# EAGLE design TSOC_GROVEY_ADC (EAGLE 6.6.0)
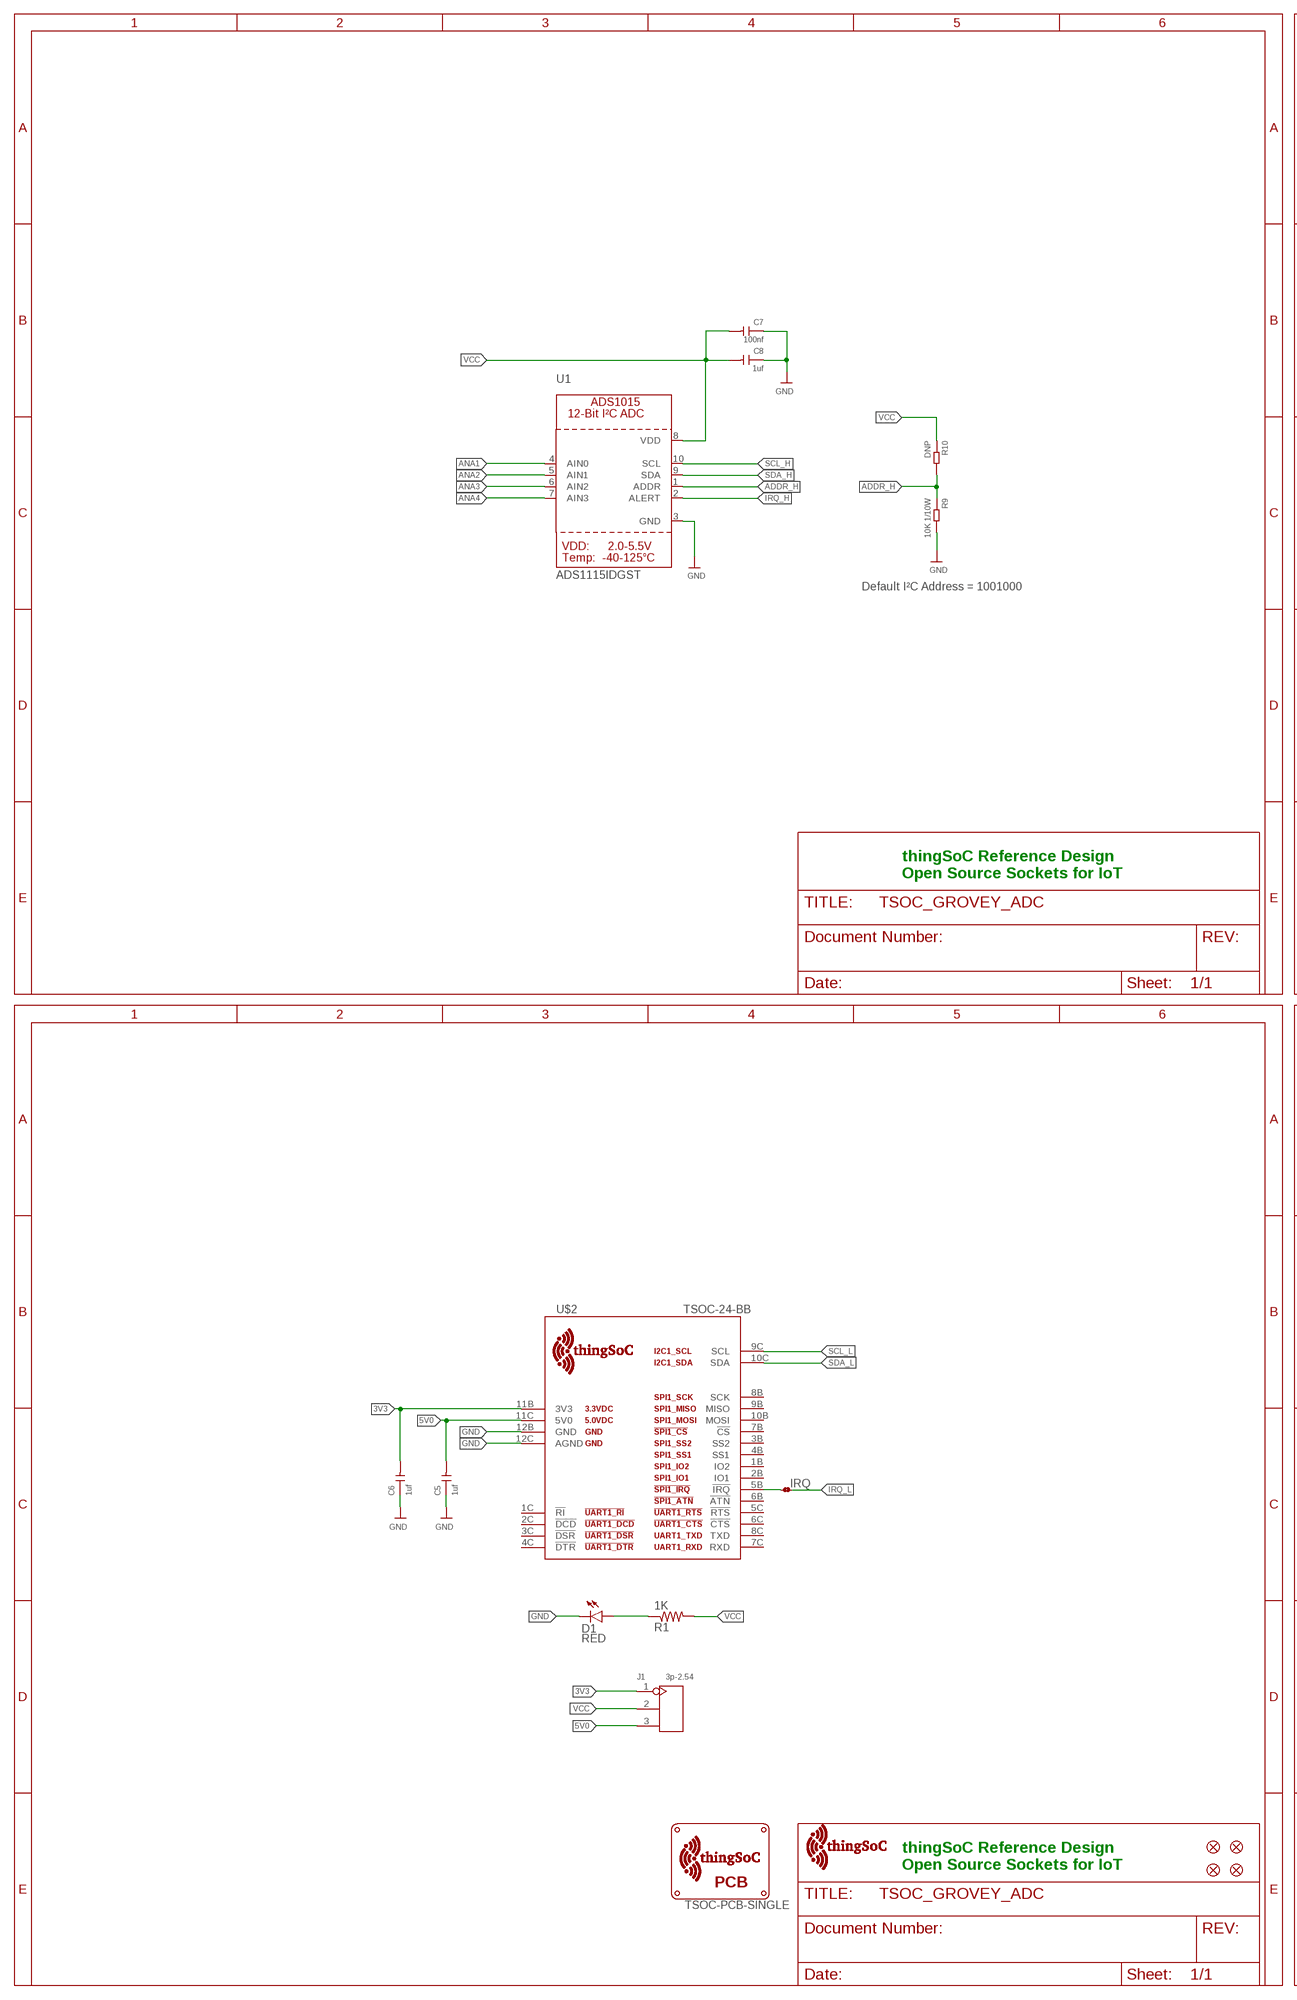
[diagram p0: schematic, sheet 1, part 1 of 2]
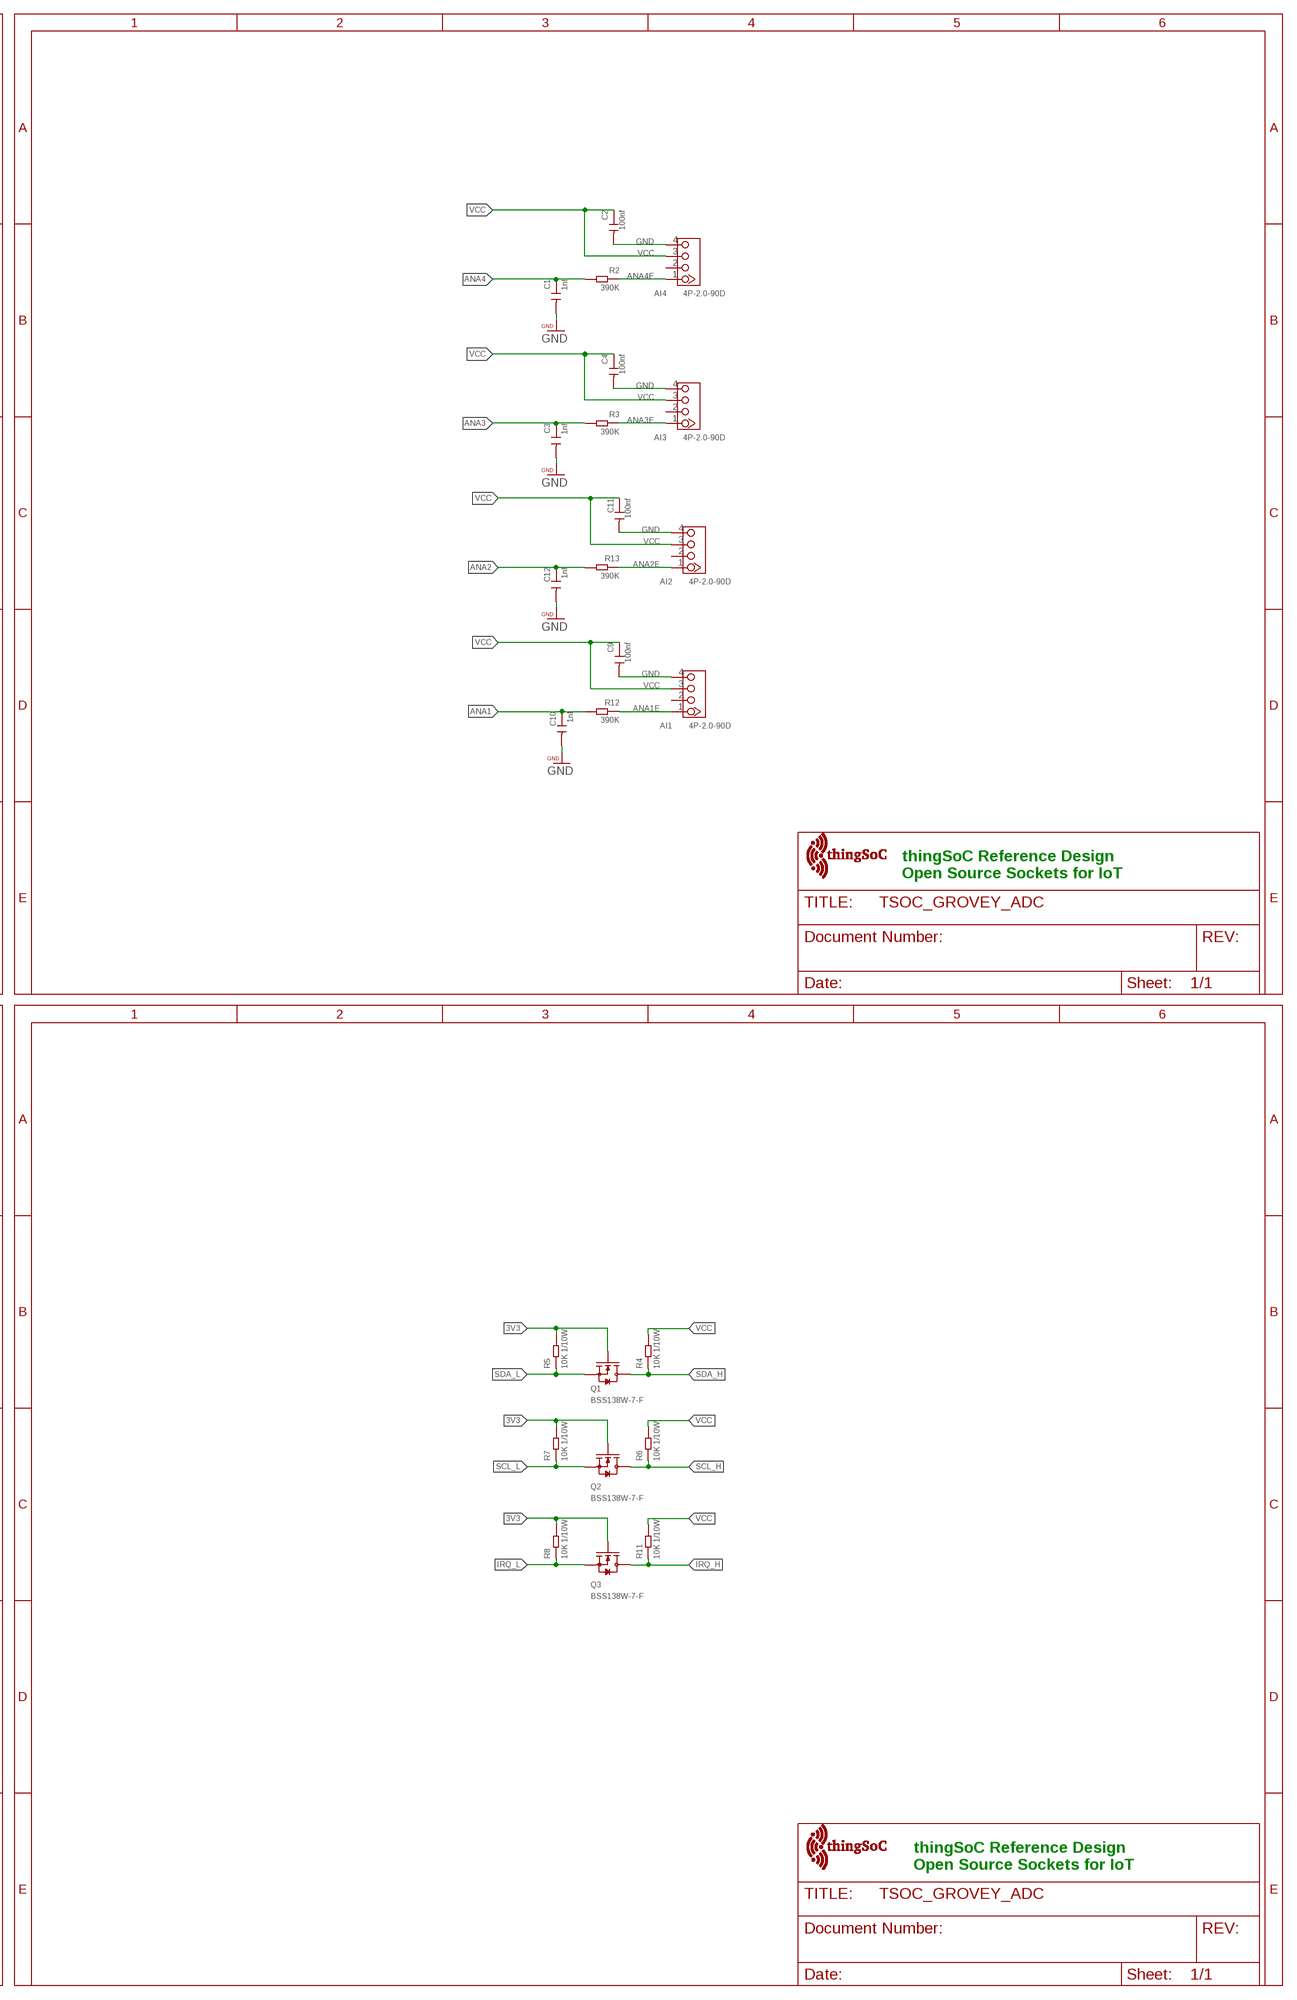
[diagram p1: schematic, sheet 1, part 2 of 2]

## Parts
AI1  4P-2.0-90D  GROVE-CONNECTOR-DIP-90D(4P-2.0)  [HW4-2.0-90D]
AI2  4P-2.0-90D  GROVE-CONNECTOR-DIP-90D(4P-2.0)  [HW4-2.0-90D]
AI3  4P-2.0-90D  GROVE-CONNECTOR-DIP-90D(4P-2.0)  [HW4-2.0-90D]
AI4  4P-2.0-90D  GROVE-CONNECTOR-DIP-90D(4P-2.0)  [HW4-2.0-90D]
C1  1nf  CERAMIC-1NF-50V-5%-C0G(0603)  [C0603]
C2  100nf  CERAMIC-100NF-50V-10%-X7R(0603)  [C0603]
C3  1nf  CERAMIC-1NF-50V-5%-C0G(0603)  [C0603]
C4  100nf  CERAMIC-100NF-50V-10%-X7R(0603)  [C0603]
C5  1uf  CERAMIC-1UF-25V-10%-X7R(0603)  [C0603]
C6  1uf  CERAMIC-1UF-25V-10%-X7R(0603)  [C0603]
C7  100nf  CERAMIC-100NF-50V-10%-X7R(0603)  [C0603]
C8  1uf  CERAMIC-1UF-25V-10%-X7R(0603)  [C0603]
C9  100nf  CERAMIC-100NF-50V-10%-X7R(0603)  [C0603]
C10  1nf  CERAMIC-1NF-50V-5%-C0G(0603)  [C0603]
C11  100nf  CERAMIC-100NF-50V-10%-X7R(0603)  [C0603]
C12  1nf  CERAMIC-1NF-50V-5%-C0G(0603)  [C0603]
D1  RED  LED0603  [LED-0603]
FID1  FIDUCIALUFIDUCIAL  [MICRO-FIDUCIAL]
FID2  FIDUCIALUFIDUCIAL  [MICRO-FIDUCIAL]
FID3  FIDUCIALUFIDUCIAL  [MICRO-FIDUCIAL]
FID4  FIDUCIALUFIDUCIAL  [MICRO-FIDUCIAL]
IRQ  JMP-2-NO  [JMP-2-NO]
J1  3p-2.54  DIP-BLACK-MALE-HEADER-VERT(3P-2.54)  [H3-2.54]
Q1  BSS138W-7-F  SMD-MOSFET-N-CH-50V-200MA-BSS138W-7-F(SOT-23)  [SOT-23]
Q2  BSS138W-7-F  SMD-MOSFET-N-CH-50V-200MA-BSS138W-7-F(SOT-23)  [SOT-23]
Q3  BSS138W-7-F  SMD-MOSFET-N-CH-50V-200MA-BSS138W-7-F(SOT-23)  [SOT-23]
R1  1K  RESISTOR_SFE0603-RES  [0603-RES]
R2  390K  SMD-RES-150K-1%-1/10W(0603)  [R0603]
R3  390K  SMD-RES-150K-1%-1/10W(0603)  [R0603]
R4  10K 1/10W  SMD-RES-10K-5%-1/10W(0603)  [R0603]
R5  10K 1/10W  SMD-RES-10K-5%-1/10W(0603)  [R0603]
R6  10K 1/10W  SMD-RES-10K-5%-1/10W(0603)  [R0603]
R7  10K 1/10W  SMD-RES-10K-5%-1/10W(0603)  [R0603]
R8  10K 1/10W  SMD-RES-10K-5%-1/10W(0603)  [R0603]
R9  10K 1/10W  SMD-RES-10K-5%-1/10W(0603)  [R0603]
R10  DNP  SMD-RES-10K-5%-1/10W(0603)  [R0603]
R11  10K 1/10W  SMD-RES-10K-5%-1/10W(0603)  [R0603]
R12  390K  SMD-RES-150K-1%-1/10W(0603)  [R0603]
R13  390K  SMD-RES-150K-1%-1/10W(0603)  [R0603]
U1  ADS1115IDGST  ADC_ADS1015  [MSOP10]
U$1  TSOC-PCB-SINGLE  [TSOC-BB-BRD-DIM]
U$2  TSOC-24-BB  [TSOC-BB-S24]
U$100  TSOC-LOGO-SMALL  [TSOC-LOGO-SML]
U$102  TSOC-LOGO-LRG  [TSOC-LOGO-LRG]
U$103  TSOC-LOGO-SMALL  [TSOC-LOGO-SML]

## Nets
3V3: C6.2 J1.1 Q1.1(G) Q2.1(G) Q3.1(G) R5.2 R7.2 R8.2 U$2.11B(3V3)
5V0: C5.2 J1.3 U$2.11C(5V0)
ADDR_H: R9.1 R10.2 U1.1(ADDR)
ANA1: C10.1 R12.2 U1.4(AIN0)
ANA1E: AI1.1 R12.1
ANA2: C12.1 R13.2 U1.5(AIN1)
ANA2E: AI2.1 R13.1
ANA3: C3.1 R3.2 U1.6(AIN2)
ANA3E: AI3.1 R3.1
ANA4: C1.1 R2.2 U1.7(AIN3)
ANA4E: AI4.1 R2.1
GND: AI1.4 AI2.4 AI3.4 AI4.4 C1.2 C2.2 C3.2 C4.2 C5.1 C6.1 C7.1 C8.1 C9.2 C10.2 C11.2 C12.2 D1.C R9.2 U1.3(GND) U$2.12B(GND) U$2.12C(AGND)
IRQ_H: Q3.3(D) R11.1 U1.2(ALERT)
IRQ_L: IRQ.2 Q3.2(S) R8.1
IRQE: IRQ.1 U$2.5B(!IRQ)
N$17: D1.A R1.1
SCL_H: Q2.3(D) R6.1 U1.10(SCL)
SCL_L: Q2.2(S) R7.1 U$2.9C(SCL)
SDA_H: Q1.3(D) R4.1 U1.9(SDA)
SDA_L: Q1.2(S) R5.1 U$2.10C(SDA)
VCC: AI1.3 AI2.3 AI3.3 AI4.3 C2.1 C4.1 C7.2 C8.2 C9.1 C11.1 J1.2 R1.2 R4.2 R6.2 R10.1 R11.2 U1.8(VDD)
Unconnected: AI1.2 AI2.2 AI3.2 AI4.2 U$2.1B(IO2) U$2.1C(!RI) U$2.2B(IO1) U$2.2C(!DCD) U$2.3B(SS2) U$2.3C(!DSR) U$2.4B(SS1) U$2.4C(!DTR) U$2.5C(!RTS) U$2.6B(!ATN) U$2.6C(!CTS) U$2.7B(!CS) U$2.7C(RXD) U$2.8B(SCK) U$2.8C(TXD) U$2.9B(MISO) U$2.10B(MOSI)

## Notes on the sheet
- Default I²C Address = 1001000
- thingSoC Reference Design
  Open Source Sockets for IoT
- thingSoC Reference Design
  Open Source Sockets for IoT
- thingSoC Reference Design
  Open Source Sockets for IoT
- thingSoC Reference Design
  Open Source Sockets for IoT

## Library data of the parts
AI1-AI4 = Seeed-Connector -2016:GROVE-CONNECTOR-DIP-90D(4P-2.0): 320110034
C1 C3 C10 C12 = Seeed-Capacitor-2016:CERAMIC-1NF-50V-5%-C0G(0603): 302010341; MPN: GRM1885C1H102JA01D
C2 C4 C7 C9 C11 = Seeed-Capacitor-2016:CERAMIC-100NF-50V-10%-X7R(0603): 302010138; MPN: CC0603KRX7R9BB104
C5 C6 C8 = Seeed-Capacitor-2016:CERAMIC-1UF-25V-10%-X7R(0603): 302010139; MPN: CC0603KRX7R8BB105
D1 = TSOC-ESP8266-BASE:LED: LEDs Standard schematic elements and footprints for 5mm, 3mm, 1206, and 0603 sized LEDs. 5mm - Spark Fun Electronics SKU : COM-00529 (and others)
FID1-FID4 = TSOC-ESP8266-BASE:FIDUCIAL: Fiducial Alignment Points Various fiducial points for machine vision alignment.
IRQ = PatternAgents-ProtoPads:JMP-2-NO: Two Terminal Jumper - Normally Open Positions 1 and 2 are normally NOT connected. PatternAgents ProtoPads Library Schematic and PCB layout libraries for design patterns by PatternAgents. For the CADSoft Eagle CAD program : http://www.cadsoftusa.com/download-eagle/ Source LBR : http://www.patternagents.com Github : https://github.com/PatternAgents License : http://creativecommons.org/licenses/by-sa/4.0/ (Creative Commons 4.0) THIS SOFTWARE IS PROVIDED BY THE CONTRIBUTORS "AS IS" AND WITHOUT ANY EXPRESS OR IMPLIED WARRANTIES, INCLUDING, BUT NOT LIMITED TO, THE IMPLIED WARRANTIES OF MERCHANTABILITY AND FITNESS FOR A PARTICULAR PURPOSE ARE DISCLAIMED. IN NO EVENT SHALL THE COPYRIGHT OWNER OR CONTRIBUTORS BE LIABLE FOR ANY DIRECT, INDIRECT, INCIDENTAL, SPECIAL, EXEMPLARY, OR CONSEQUENTIAL DAMAGES (INCLUDING, BUT NOT LIMITED TO, PROCUREMENT OF SUBSTITUTE GOODS OR SERVICES; LOSS OF USE, DATA, OR PROFITS; OR BUSINESS INTERRUPTION) HOWEVER CAUSED AND ON ANY THEORY OF LIABILITY, WHETHER IN CONTRACT, STRICT LIABILITY, OR TORT (INCLUDING NEGLIGENCE OR OTHERWISE) ARISING IN ANY WAY OUT OF THE USE OF THIS SOFTWARE, EVEN IF ADVISED OF THE POSSIBILITY OF SUCH DAMAGE.; BOM: EXCLUDE
J1 = Seeed-Connector -2016:DIP-BLACK-MALE-HEADER-VERT(3P-2.54): 320020079
Q1-Q3 = Seeed-Transistor-2016:SMD-MOSFET-N-CH-50V-200MA-BSS138W-7-F(SOT-23): 305030000; MPN: BSS138W-7-F
R1 = PatternAgents-Misc:RESISTOR_SFE: Resistor Basic schematic elements and footprints for 0603, 1206, and PTH resistors.
R2 R3 R12 R13 = Seeed-Resistor-2016:SMD-RES-150K-1%-1/10W(0603): 301010205; MPN: RC0603FR-07150KL; VALUE: 150K
R4-R9 R11 = Seeed-Resistor-2016:SMD-RES-10K-5%-1/10W(0603): 301010293; MPN: RC0603JR-0710KL
R10 = Seeed-Resistor-2016:SMD-RES-10K-5%-1/10W(0603): 301010293; MPN: RC0603JR-0710KL; VALUE: 10K 1/10W
U1 = microbuilder:ADC_ADS1015: ADS1015 - 12-bit 4-Channel I2C ADC with Internal PGA VDD: 2.0-5.5V Sampling Rate: 3.3ksps Gain Settings: 2/3, 1, 2, 4, 8, 16 I2C Address: ADDR low = 1001000x, ADDR high = 1001001x Internal Comparator The ADS1015 includes an internal comparator that can be set to output a high-level on ALERT when the conversion results exceeeds a pre-defined upper level, and will deassert itself when the level falls below a pre-defined lower threshold level. It can also be set to windowed mode where the ALERT pin will be asserted if the data exceeds the upper threshold or falls below the lower threshold.
U$1 = thingSoC:TSOC-PCB: thingSoC PCB Outlines Boards Outlines for Standard Sizes (in the DImension Layer) (Registration marks in the tDocu layer - make sure to turn on tDocu/bDocu) Source LBR : http://www.thingsoc.com Github : https://github.com/thingsoc License : http://creativecommons.org/licenses/by-sa/4.0/ (Creative Commons 4.0) THIS SOFTWARE IS PROVIDED BY THE CONTRIBUTORS "AS IS" AND WITHOUT ANY EXPRESS OR IMPLIED WARRANTIES, INCLUDING, BUT NOT LIMITED TO, THE IMPLIED WARRANTIES OF MERCHANTABILITY AND FITNESS FOR A PARTICULAR PURPOSE ARE DISCLAIMED. IN NO EVENT SHALL THE COPYRIGHT OWNER OR CONTRIBUTORS BE LIABLE FOR ANY DIRECT, INDIRECT, INCIDENTAL, SPECIAL, EXEMPLARY, OR CONSEQUENTIAL DAMAGES (INCLUDING, BUT NOT LIMITED TO, PROCUREMENT OF SUBSTITUTE GOODS OR SERVICES; LOSS OF USE, DATA, OR PROFITS; OR BUSINESS INTERRUPTION) HOWEVER CAUSED AND ON ANY THEORY OF LIABILITY, WHETHER IN CONTRACT, STRICT LIABILITY, OR TORT (INCLUDING NEGLIGENCE OR OTHERWISE) ARISING IN ANY WAY OUT OF THE USE OF THIS SOFTWARE, EVEN IF ADVISED OF THE POSSIBILITY OF SUCH DAMAGE.
U$2 = thingSoC:TSOC-24: thingSoC Twenty-Four(24) Pin Socket Source LBR : http://www.thingsoc.com Github : https://github.com/thingsoc License : http://creativecommons.org/licenses/by-sa/4.0/ (Creative Commons 4.0) THIS SOFTWARE IS PROVIDED BY THE CONTRIBUTORS "AS IS" AND WITHOUT ANY EXPRESS OR IMPLIED WARRANTIES, INCLUDING, BUT NOT LIMITED TO, THE IMPLIED WARRANTIES OF MERCHANTABILITY AND FITNESS FOR A PARTICULAR PURPOSE ARE DISCLAIMED. IN NO EVENT SHALL THE COPYRIGHT OWNER OR CONTRIBUTORS BE LIABLE FOR ANY DIRECT, INDIRECT, INCIDENTAL, SPECIAL, EXEMPLARY, OR CONSEQUENTIAL DAMAGES (INCLUDING, BUT NOT LIMITED TO, PROCUREMENT OF SUBSTITUTE GOODS OR SERVICES; LOSS OF USE, DATA, OR PROFITS; OR BUSINESS INTERRUPTION) HOWEVER CAUSED AND ON ANY THEORY OF LIABILITY, WHETHER IN CONTRACT, STRICT LIABILITY, OR TORT (INCLUDING NEGLIGENCE OR OTHERWISE) ARISING IN ANY WAY OUT OF THE USE OF THIS SOFTWARE, EVEN IF ADVISED OF THE POSSIBILITY OF SUCH DAMAGE.
U$100 U$102 U$103 = thingSoC:TSOC-LOGO: thingSoC Logo Source LBR : http://www.thingsoc.com Github : https://github.com/thingsoc License : http://creativecommons.org/licenses/by-sa/4.0/ (Creative Commons 4.0) THIS SOFTWARE IS PROVIDED BY THE CONTRIBUTORS "AS IS" AND WITHOUT ANY EXPRESS OR IMPLIED WARRANTIES, INCLUDING, BUT NOT LIMITED TO, THE IMPLIED WARRANTIES OF MERCHANTABILITY AND FITNESS FOR A PARTICULAR PURPOSE ARE DISCLAIMED. IN NO EVENT SHALL THE COPYRIGHT OWNER OR CONTRIBUTORS BE LIABLE FOR ANY DIRECT, INDIRECT, INCIDENTAL, SPECIAL, EXEMPLARY, OR CONSEQUENTIAL DAMAGES (INCLUDING, BUT NOT LIMITED TO, PROCUREMENT OF SUBSTITUTE GOODS OR SERVICES; LOSS OF USE, DATA, OR PROFITS; OR BUSINESS INTERRUPTION) HOWEVER CAUSED AND ON ANY THEORY OF LIABILITY, WHETHER IN CONTRACT, STRICT LIABILITY, OR TORT (INCLUDING NEGLIGENCE OR OTHERWISE) ARISING IN ANY WAY OUT OF THE USE OF THIS SOFTWARE, EVEN IF ADVISED OF THE POSSIBILITY OF SUCH DAMAGE.

## Board
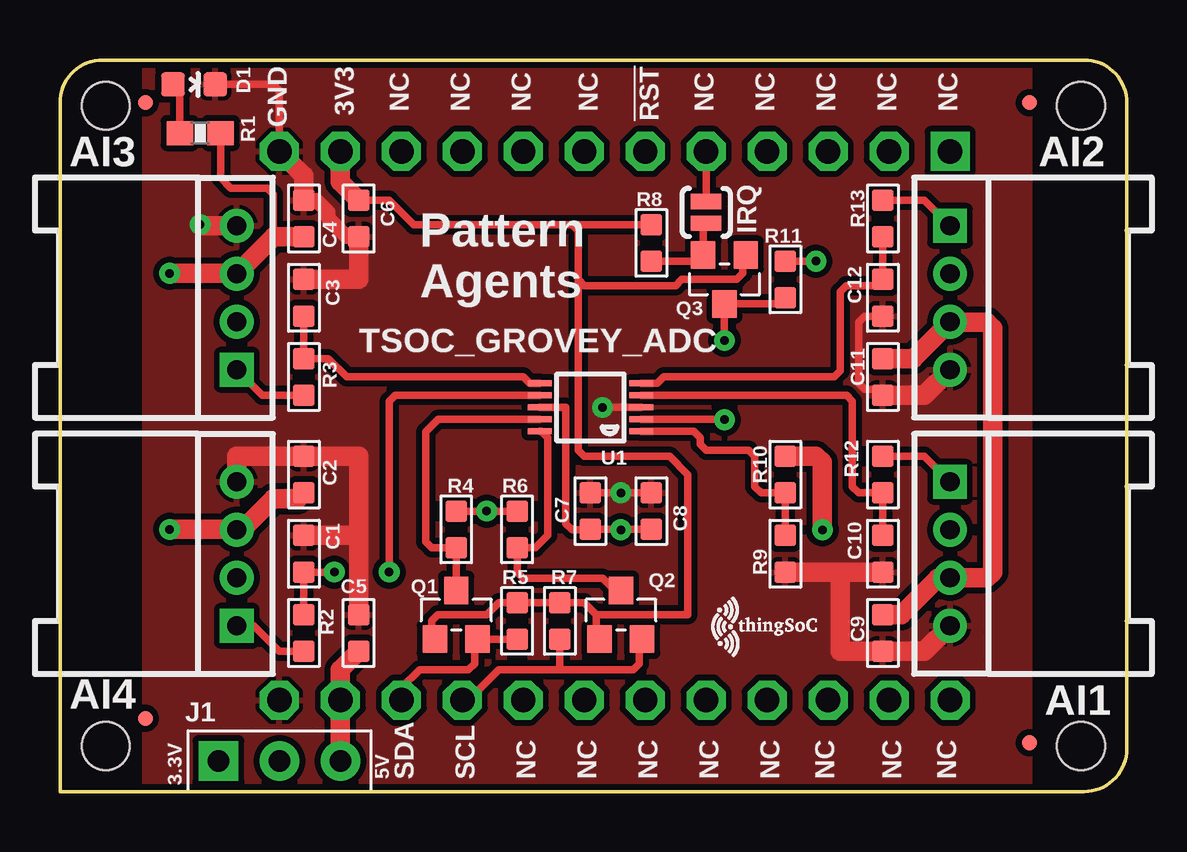
[diagram p2: board, top side]
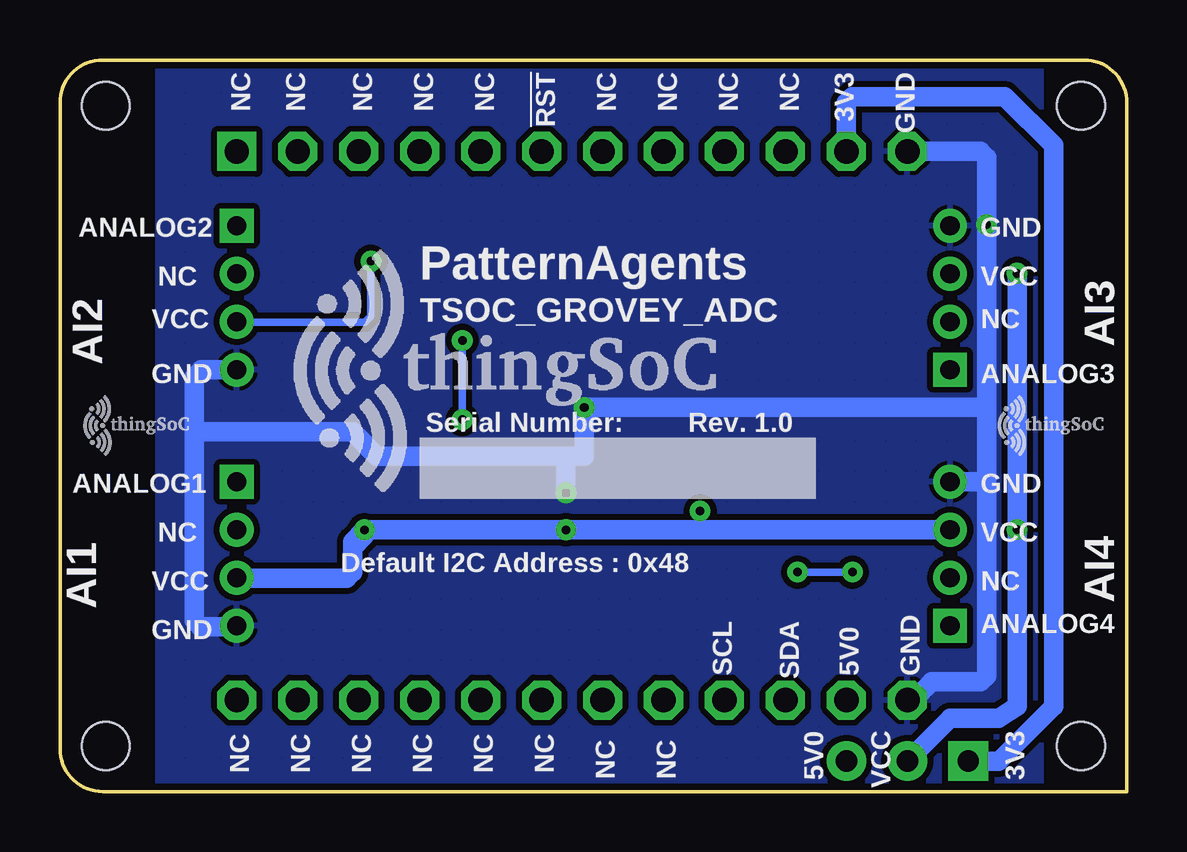
[diagram p3: board, bottom side, seen from below]

Size 44.45 x 30.48 mm. Coordinates in mm from the lower left corner, seen from the top.
Copper layers (1*16): Top 0.035mm / dielectric 1.5mm / Bottom 0.035mm
Design rules "PatternAgents_7mil": minimum track width 7mil, minimum drill 14mil, track to track 7mil, track to pad 7mil, pad to pad 7mil, via to via 7mil, smd to smd 7mil, copper to edge 7mil, drill to drill 7mil, minimum pad ring 12mil, minimum via ring 10mil, stop-mask expansion 4mil, vias tented up to drill 25mil, thermal gap 7mil

### Footprints (pad centres in the part's own frame; a part is rotated, then mirrored left to right if it is on the bottom)
HW4-2.0-90D = drill 0.8 pad 1.27 square: 1 -3,0 | drill 0.8 pad 1.27: 2 -1,0; 3 1,0; 4 3,0
C0603 = smd 0.889 x 0.889: 1 0,0.762; 2 0,-0.762
LED-0603 = smd 1 x 1: A 0,-0.877; C 0,0.877
MICRO-FIDUCIAL = smd 0.635 x 0.635: 1 0,0
JMP-2-NO = smd 0.635 x 1.27: 1 -0.45,0; 2 0.45,0
H3-2.54 = drill 0.889 pad 1.651 square: 1 0,2.54 | drill 0.889 pad 1.651: 2 0,0; 3 0,-2.54
SOT-23 = smd 1.016 x 1.143: 1 -0.889,-1.016; 2 0.889,-1.016; 3 0,1.016
0603-RES = smd 1.1 x 1: 1 -0.85,0; 2 0.85,0
R0603 = smd 0.889 x 0.889: 1 0,0.762; 2 0,-0.762
MSOP10 = smd 0.25 x 1: 1 -1,-2.113; 2 -0.5,-2.113; 3 0,-2.113; 4 0.5,-2.113; 5 1,-2.113; 6 1,2.113; 7 0.5,2.113; 8 0,2.113; 9 -0.5,2.113; 10 -1,2.113
TSOC-BB-BRD-DIM = hole 2: 13.335,16.891; -13.335,16.891; 13.335,-23.749; -13.335,-23.749
TSOC-BB-S24 = drill 1.016 square: 1B -11.43,11.43 | drill 1.016 octagon: 1C 11.43,11.43; 2B -11.43,8.89; 2C 11.43,8.89; 3B -11.43,6.35; 3C 11.43,6.35; 4B -11.43,3.81; 4C 11.43,3.81; 5B -11.43,1.27; 5C 11.43,1.27; 6B -11.43,-1.27; 6C 11.43,-1.27; 7B -11.43,-3.81; 7C 11.43,-3.81; 8B -11.43,-6.35; 8C 11.43,-6.35; 9B -11.43,-8.89; 9C 11.43,-8.89; 10B -11.43,-11.43; 10C 11.43,-11.43; 11B -11.43,-13.97; 11C 11.43,-13.97; 12B -11.43,-16.51; 12C 11.43,-16.51

### Placement (x,y rotation side)
AI1  37.08,9.91 270 top
AI2  37.08,20.57 270 top
AI3  7.37,20.57 90 top
AI4  7.37,9.91 90 top
C1  10.16,9.91 180 top
C2  10.16,13.21 180 top
C3  10.16,20.57 180 top
C4  10.16,23.88 180 top
C5  12.45,6.6 0 top
C6  12.45,23.88 180 top
C7  22.1,11.68 0 top
C8  24.64,11.68 0 top
C9  34.29,6.6 0 top
C10  34.29,9.91 0 top
C11  34.29,17.27 0 top
C12  34.29,20.57 0 top
D1  5.59,29.46 270 top
FID1  3.56,3.05 0 top
FID2  3.56,28.7 0 top
FID3  40.39,2.03 0 top
FID4  40.39,28.7 0 top
IRQ  26.92,24.13 270 top
J1  9.14,1.27 90 top
Q1  16.51,7.37 0 top
Q2  23.37,7.37 0 top
Q3  27.69,21.34 180 top
R1  5.84,27.43 0 top
R2  10.16,6.6 180 top
R3  10.16,17.27 180 top
R4  16.51,10.92 180 top
R5  19.05,7.11 180 top
R6  19.05,10.92 180 top
R7  20.83,7.11 180 top
R8  24.64,22.86 180 top
R9  30.23,9.91 0 top
R10  30.23,13.21 0 top
R11  30.23,21.34 180 top
R12  34.29,13.21 0 top
R13  34.29,23.88 0 top
U1  22.1,16 90 top
U$1  25.65,15.24 270 top
U$2  25.65,15.24 270 top
U$100  4.57,15.24 0 bottom
U$101  TSOC-LOGO-SMALL  [TSOC-LOGO-SML]  27.94,6.86 0 top
U$102  31.5,17.53 0 bottom
U$103  42.67,15.24 0 bottom

### Tracks (layer width: path | path; a pad name or v marks a point on that pad's centre or on a via)
3V3
  Top 0.305: Q1.1 15.49,6.48 15.49,7.11 15.75,7.37 17.78,7.37 18.29,7.87 R5.2 R7.2 21.84,7.87 22.35,7.37 | 22.61,6.48 Q2.1 22.35,6.48 22.35,7.37 | Q3.1 28.45,22.23 28.45,21.59 28.19,21.34 25.91,21.34 25.65,21.08 21.84,21.08 21.59,21.34 | R8.2 21.34,23.62 | 21.34,23.62 14.73,23.62 13.72,24.64 C6.2 | 21.59,21.34 21.59,14.22 21.84,13.97 25.4,13.97 26.16,13.21 26.16,7.37 22.35,7.37 | 21.59,21.34 21.59,23.37 21.34,23.62
  Top 0.813: C6.2 11.68,25.4 U$2.11B
  Bottom 0.813: U$2.11B 11.68,28.7 11.43,28.96 5.08,28.96 3.05,26.92 3.05,3.56 5.33,1.27 J1.1
5V0
  Top 0.813: J1.3 U$2.11C 11.68,5.08 C5.2
ADDR_H
  Top 0.305: R9.1 R10.2 29.21,12.45 28.96,12.7 28.96,13.97 28.7,14.22 26.92,14.22 26.67,14.48 26.67,14.73 26.4,15 U1.1
ANA1
  Top 0.305: U1.4 32.77,16.5 33.02,16.26 33.02,12.7 33.27,12.45 R12.2 C10.1
ANA1E
  Top 0.305: R12.1 36.02,13.97 AI1.1
ANA2
  Top 0.305: R13.2 C12.1 34.04,21.08 32.77,21.08 32.51,20.83 32.51,17.53 32.26,17.27 25.15,17.27 24.88,17 U1.5
ANA2E
  Top 0.305: R13.1 36.02,24.64 AI2.1
ANA3
  Top 0.305: C3.1 R3.2 11.18,18.03 11.94,17.27 19.3,17.27 19.57,17 U1.6
ANA3E
  Top 0.305: R3.1 8.43,16.51 AI3.1
ANA4  (via drill 0.36)
  Top 0.305: R2.2 C1.1 v11.43,9.14 | v13.72,9.14 13.72,16.26 13.97,16.51 13.98,16.5 U1.7
  Bottom 0.305: v11.43,9.14 v13.72,9.14
ANA4E
  Top 0.305: AI4.1 8.08,6.91 9.14,5.84 R2.1
GND  (via drill 0.36)
  Top 0.305: D1.C 8.89,29.46 9.14,29.21 U$2.12B | C7.1 v23.37,12.45 C8.1 | C12.2 33.53,19.81 33.27,19.56 33.27,17.02 33.53,16.76 34.04,16.76 C11.2 | U1.3 v22.61,16
  Top 0.61: C4.2 10.67,24.64 11.18,24.13 11.18,23.88 11.94,23.11 C6.1
  Top 0.813: C1.2 12.45,10.67 | 12.45,10.67 C5.1 | 12.45,10.67 12.45,13.97 C2.2 7.37,13.97 AI4.4 | AI3.4 5.89,23.57 v5.84,23.62 | C4.2 10.16,25.65 U$2.12B | C6.1 12.45,21.34 C3.2 | C11.2 36.02,16.51 AI2.4 | AI1.4 36.02,5.84 C9.2 32.51,5.84 32.51,9.14 | 32.51,9.14 C10.2 | R9.2 32.51,9.14
  Bottom 0.813: U$2.12C 8.89,3.81 8.13,4.57 6.1,4.57 5.84,4.83 5.84,12.95 | 5.84,12.95 5.84,15.75 | 5.84,15.75 v5.84,23.62 5.84,26.42 6.1,26.67 U$2.12B | 5.84,15.75 6.1,16 v22.61,16 22.61,13.97 23.37,13.97 | AI4.4 5.89,12.91 5.84,12.95 | 23.37,13.97 31.24,13.97 32.26,14.99 38.61,14.99 38.86,14.73 | AI2.4 38.56,17.57 38.86,17.27 38.86,14.73 | 38.86,14.73 38.86,7.11 38.61,6.86 37.13,6.86 AI1.4 | v23.37,12.45 23.37,13.97
  pour Top (isolate 0.254, rank 2, hatched): 3.56,0 3.56,30.48 40.39,30.48 40.39,0
  pour Bottom (isolate 0.254, rank 2, hatched): 3.56,0 3.56,30.48 40.39,30.48 40.39,0
IRQ_H  (via drill 0.36)
  Top 0.305: U1.2 27.44,15.5 v27.69,15.49 | v27.69,18.8 Q3.3 29.97,20.32 R11.1
  Bottom 0.305: v27.69,15.49 v27.69,18.8
IRQ_L
  Top 0.305: R8.1 26.54,22.1 Q3.2 26.8,23.55 IRQ.2
IRQE
  Top 0.305: IRQ.1 U$2.5B
N$17
  Top 0.305: R1.1 4.99,29.18 D1.A
SCL_H
  Top 0.305: U1.10 20.05,15 20.32,14.73 20.32,10.67 19.81,10.16 R6.1 19.05,9.14 19.3,8.89 22.61,8.89 23.11,8.38 Q2.3
SCL_L
  Top 0.305: U$2.9C 17.02,3.81 18.29,5.08 20.83,5.08 | 20.83,5.08 23.88,5.08 24.13,5.33 24.13,6.22 Q2.2 | R7.1 20.83,5.08
SDA_H
  Top 0.305: Q1.3 R4.1 15.49,10.16 15.24,10.41 15.24,14.99 15.76,15.5 U1.9
SDA_L
  Top 0.305: R5.1 Q1.2 17.27,6.22 17.27,5.33 17.02,5.08 14.99,5.08 14.22,4.32 U$2.10C
VCC  (via drill 0.36)
  Top 0.305: R1.2 6.69,25.57 7.11,25.15 8.64,25.15 8.89,24.89 8.89,23.13 8.91,23.11 | R11.2 v31.5,22.1 | R4.2 v17.78,11.68 R6.2 | C8.2 23.64,10.92 v23.37,10.91 23.35,10.92 C7.2 22.08,10.91 21.34,10.91 21.08,11.16 21.08,16 U1.8
  Top 0.813: v4.57,21.59 7.35,21.59 AI3.3 8.91,23.11 C4.1 | C11.1 35.54,18.03 AI2.3 37.1,19.56 38.61,19.56 38.86,19.3 38.86,9.14 38.62,8.91 AI1.3 37.07,8.89 36.58,8.89 35.05,7.37 C9.1 | v4.57,10.92 7.35,10.92 AI4.3 7.6,10.91 8.89,12.19 9.91,12.19 C2.1 | R10.1 31.5,13.97 31.75,13.72 31.75,10.92 v31.77,10.91
  Bottom 0.305: v31.5,22.1 31.5,19.81 31.75,19.56 37.07,19.56 AI2.3 | v17.78,11.68 17.78,11.16 17.53,10.91
  Bottom 0.813: J1.2 7.37,3.05 5.33,3.05 4.57,3.56 v4.57,10.92 v4.57,21.59 | AI4.3 17.53,10.91 v23.37,10.91 v31.77,10.91 | v31.77,10.91 32.26,10.41 32.26,10.16 | 32.26,10.16 32.26,9.14 32.51,8.89 37.07,8.89 AI1.3 | v31.77,10.91 31.77,10.65 32.26,10.16

### Text on the board
tPlace: GND | 3V3 | NC | NC | NC | NC | !RST | NC | NC | NC | NC | NC | Pattern / Agents | TSOC_GROVEY_ADC | 5V | SDA | SCL | NC | NC | NC | NC | NC | NC | NC | NC | 3.3V
bPlace: GND | 3V3 | NC | NC | NC | NC | !RST | NC | NC | NC | NC | NC | GND | ANALOG2 | VCC | PatternAgents | NC | TSOC_GROVEY_ADC | AI3 | NC | VCC | AI2 | ANALOG3 | GND | Rev. 1.0 | Serial Number: | GND | ANALOG1 | VCC | NC | Default I2C Address : 0x48 | AI4 | NC | VCC | AI1 | ANALOG4 | SDA | SCL | GND | GND | 5V0 | 3V3 | VCC | 5V0 | NC | NC | NC | NC | NC | NC | NC | NC